# Altium project ADP-CI-V1.PrjPcb
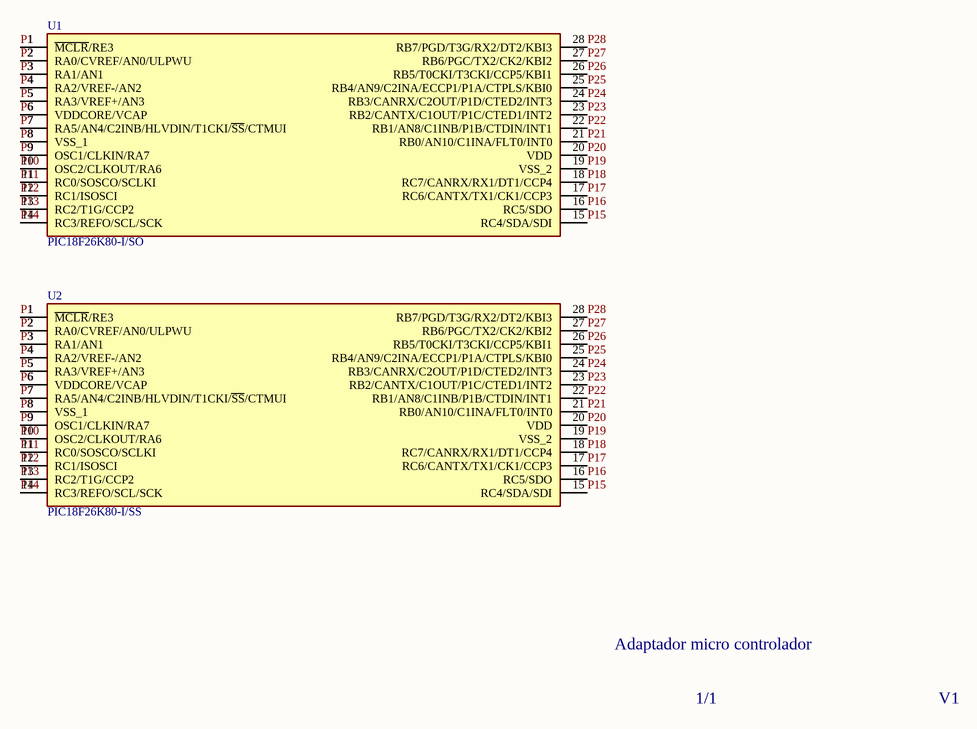
[diagram p0: ADP-CI-V1.SchDoc]
1 sheet, 2 parts. Net scope: global (net labels, ports and power ports of the same name join across sheets).
Board file: ADP-CI-V1.PcbDoc

## Sheet ADP-CI-V1.SchDoc
size A4

### Parts
U1  PIC18F26K80-I/SO  [SOIC-28]
U2  PIC18F26K80-I/SS  [SSOP-28]

### Nets
P1: U1.1(~{MCLR}/RE3) U2.1(~{MCLR}/RE3)
P2: U1.2(RA0/CVREF/AN0/ULPWU) U2.2(RA0/CVREF/AN0/ULPWU)
P3: U1.3(RA1/AN1) U2.3(RA1/AN1)
P4: U1.4(RA2/VREF-/AN2) U2.4(RA2/VREF-/AN2)
P5: U1.5(RA3/VREF+/AN3) U2.5(RA3/VREF+/AN3)
P6: U1.6(VDDCORE/VCAP) U2.6(VDDCORE/VCAP)
P7: U1.7(RA5/AN4/C2INB/HLVDIN/T1CKI/~{SS}/CTMUI) U2.7(RA5/AN4/C2INB/HLVDIN/T1CKI/~{SS}/CTMUI)
P8: U1.8(VSS_1) U2.8(VSS_1)
P9: U1.9(OSC1/CLKIN/RA7) U2.9(OSC1/CLKIN/RA7)
P10: U1.10(OSC2/CLKOUT/RA6) U2.10(OSC2/CLKOUT/RA6)
P11: U1.11(RC0/SOSCO/SCLKI) U2.11(RC0/SOSCO/SCLKI)
P12: U1.12(RC1/ISOSCI) U2.12(RC1/ISOSCI)
P13: U1.13(RC2/T1G/CCP2) U2.13(RC2/T1G/CCP2)
P14: U1.14(RC3/REFO/SCL/SCK) U2.14(RC3/REFO/SCL/SCK)
P15: U1.15(RC4/SDA/SDI) U2.15(RC4/SDA/SDI)
P16: U1.16(RC5/SDO) U2.16(RC5/SDO)
P17: U1.17(RC6/CANTX/TX1/CK1/CCP3) U2.17(RC6/CANTX/TX1/CK1/CCP3)
P18: U1.18(RC7/CANRX/RX1/DT1/CCP4) U2.18(RC7/CANRX/RX1/DT1/CCP4)
P19: U1.19(VSS_2) U2.19(VSS_2)
P20: U1.20(VDD) U2.20(VDD)
P21: U1.21(RB0/AN10/C1INA/FLT0/INT0) U2.21(RB0/AN10/C1INA/FLT0/INT0)
P22: U1.22(RB1/AN8/C1INB/P1B/CTDIN/INT1) U2.22(RB1/AN8/C1INB/P1B/CTDIN/INT1)
P23: U1.23(RB2/CANTX/C1OUT/P1C/CTED1/INT2) U2.23(RB2/CANTX/C1OUT/P1C/CTED1/INT2)
P24: U1.24(RB3/CANRX/C2OUT/P1D/CTED2/INT3) U2.24(RB3/CANRX/C2OUT/P1D/CTED2/INT3)
P25: U1.25(RB4/AN9/C2INA/ECCP1/P1A/CTPLS/KBI0) U2.25(RB4/AN9/C2INA/ECCP1/P1A/CTPLS/KBI0)
P26: U1.26(RB5/T0CKI/T3CKI/CCP5/KBI1) U2.26(RB5/T0CKI/T3CKI/CCP5/KBI1)
P27: U1.27(RB6/PGC/TX2/CK2/KBI2) U2.27(RB6/PGC/TX2/CK2/KBI2)
P28: U1.28(RB7/PGD/T3G/RX2/DT2/KBI3) U2.28(RB7/PGD/T3G/RX2/DT2/KBI3)

### Notes on the sheet
- Adaptador micro controlador
- 1/1
- V1

### Library data of the parts
U1 = PIC18F26K80-I/SO: Microcontrolador; Manufacturer_Name: Microchip; Datasheet Link: http://docs-emea.rs-online.com/webdocs/0f3b/0900766b80f3b175.pdf; Height: 2.65mm; Manufacturer_Part_Number: PIC18F26K80-I/SO; Mouser Part Number: 579-PIC18F26K80-I/SO; Mouser Price/Stock: https://www.mouser.co.uk/ProductDetail/Microchip-Technology/PIC18F26K80-I-SO/?qs=LU7oW20kJpOYxWZY%252BQBzxA%3D%3D; Arrow Part Number: PIC18F26K80-I/SO; Arrow Price/Stock: https://www.arrow.com/en/products/pic18f26k80-iso/microchip-technology
U2 = PIC18F26K80-I/SS: Microcontrolador; Manufacturer_Name: Microchip; Datasheet Link: http://docs-emea.rs-online.com/webdocs/0f3b/0900766b80f3b175.pdf; Height: 2mm; Manufacturer_Part_Number: PIC18F26K80-I/SS; Mouser Part Number: 579-PIC18F26K80-I/SS; Mouser Price/Stock: https://www.mouser.co.uk/ProductDetail/Microchip-Technology/PIC18F26K80-I-SS/?qs=LU7oW20kJpONdJWw7q21%2Fw%3D%3D; Arrow Part Number: PIC18F26K80-I/SS; Arrow Price/Stock: https://www.arrow.com/en/products/pic18f26k80-iss/microchip-technology